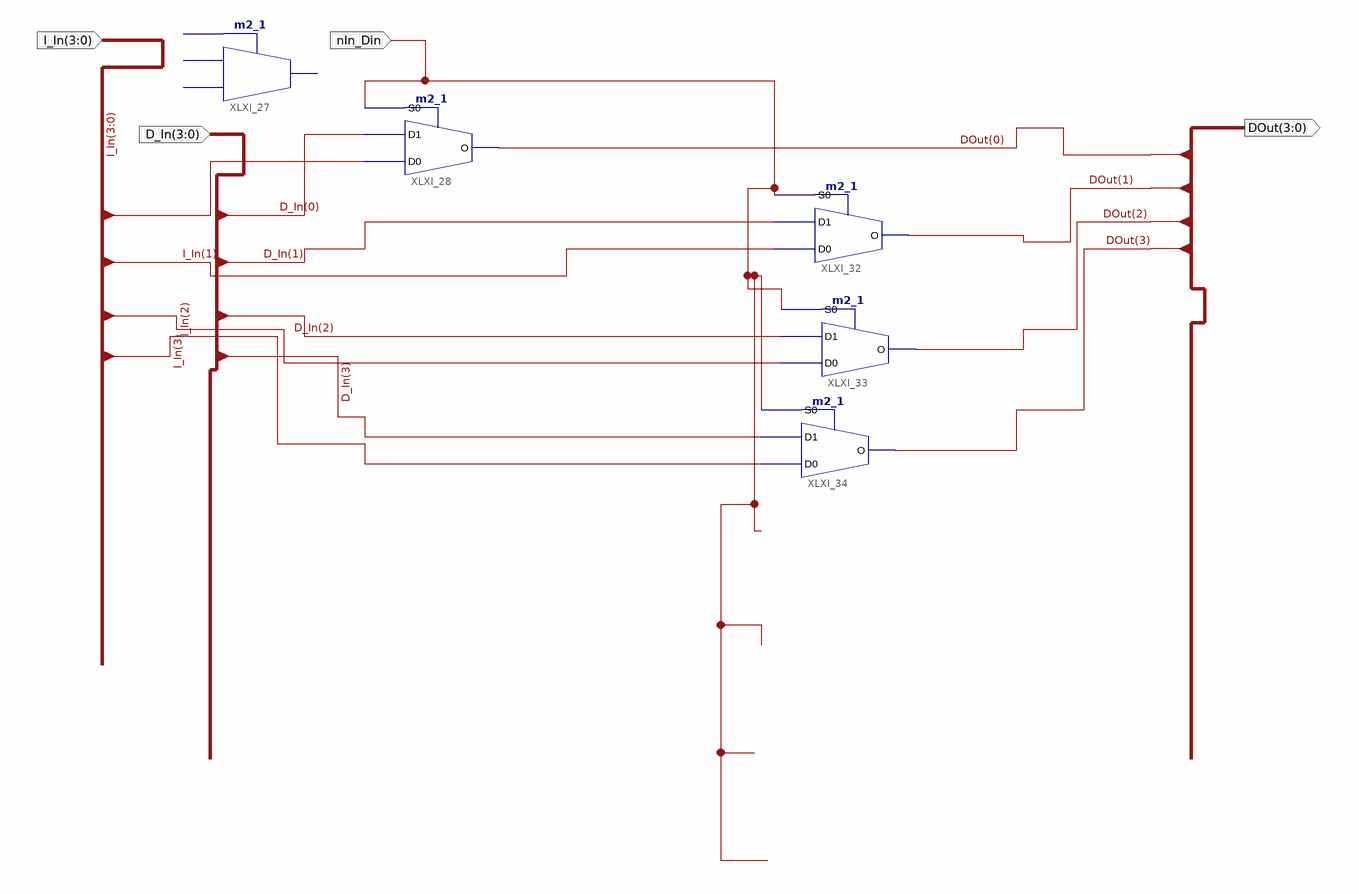
[diagram p0: schematic sheet 1]
// Xilinx ISE schematic MUX4_generic.sch (spartan3e) as structural Verilog: 5 symbols, 4 ports
module MUX4_generic (
  input  [3:0] D_In,
  input  [3:0] I_In,
  input  nIn_Din,
  output [3:0] DOut
);

  m2_1 XLXI_27 ();  // open: D0, D1, S0, O
  m2_1 XLXI_28 (.D0(I_In[0]), .D1(D_In[0]), .S0(nIn_Din), .O(DOut[0]));
  m2_1 XLXI_33 (.D0(I_In[2]), .D1(D_In[2]), .S0(nIn_Din), .O(DOut[2]));
  m2_1 XLXI_34 (.D0(I_In[3]), .D1(D_In[3]), .S0(nIn_Din), .O(DOut[3]));
  m2_1 XLXI_32 (.D0(I_In[1]), .D1(D_In[1]), .S0(nIn_Din), .O(DOut[1]));
endmodule
